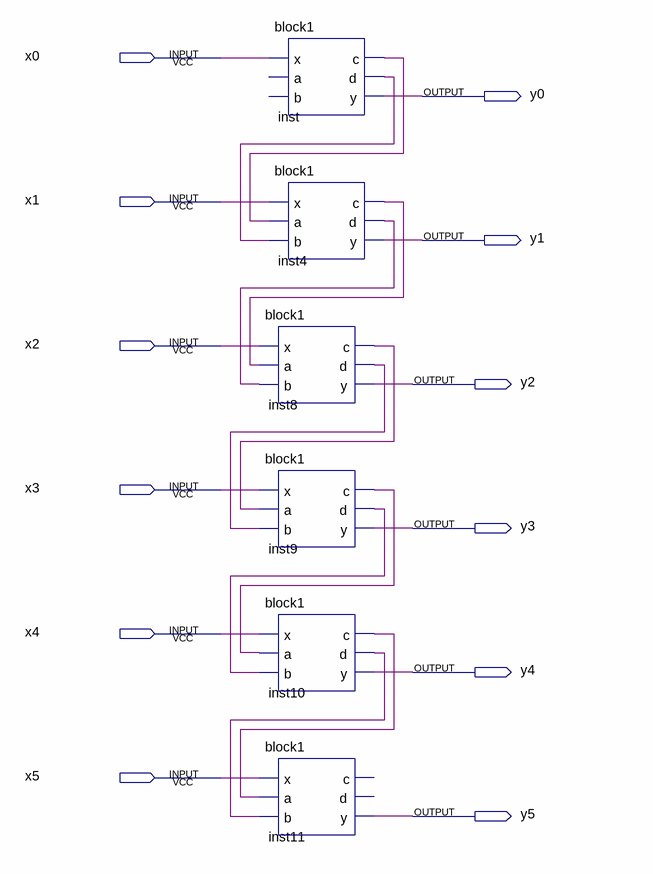
[diagram p0: schematic sheet]
// Quartus schematic ostatniaszansa.bdf as structural Verilog: 6 symbols, 12 pins
module ostatniaszansa (
  input  x0,
  input  x1,
  input  x2,
  input  x3,
  input  x4,
  input  x5,
  output y0,
  output y1,
  output y2,
  output y3,
  output y4,
  output y5
);

  wire inst4_c, inst4_d, inst8_c, inst8_d, inst9_c, inst9_d, inst10_c, inst10_d, inst_c, inst_d;

  block1 inst (.x(x0), .c(inst_c), .d(inst_d), .y(y0));  // open: a, b
  block1 inst4 (.x(x1), .a(inst_c), .b(inst_d), .c(inst4_c), .d(inst4_d), .y(y1));
  block1 inst8 (.x(x2), .a(inst4_c), .b(inst4_d), .c(inst8_c), .d(inst8_d), .y(y2));
  block1 inst9 (.x(x3), .a(inst8_c), .b(inst8_d), .c(inst9_c), .d(inst9_d), .y(y3));
  block1 inst10 (.x(x4), .a(inst9_c), .b(inst9_d), .c(inst10_c), .d(inst10_d), .y(y4));
  block1 inst11 (.x(x5), .a(inst10_c), .b(inst10_d), .y(y5));  // open: c, d
endmodule
